# EAGLE schematic RX08 (EAGLE 6.6.0)

## Sheet 1 of 3
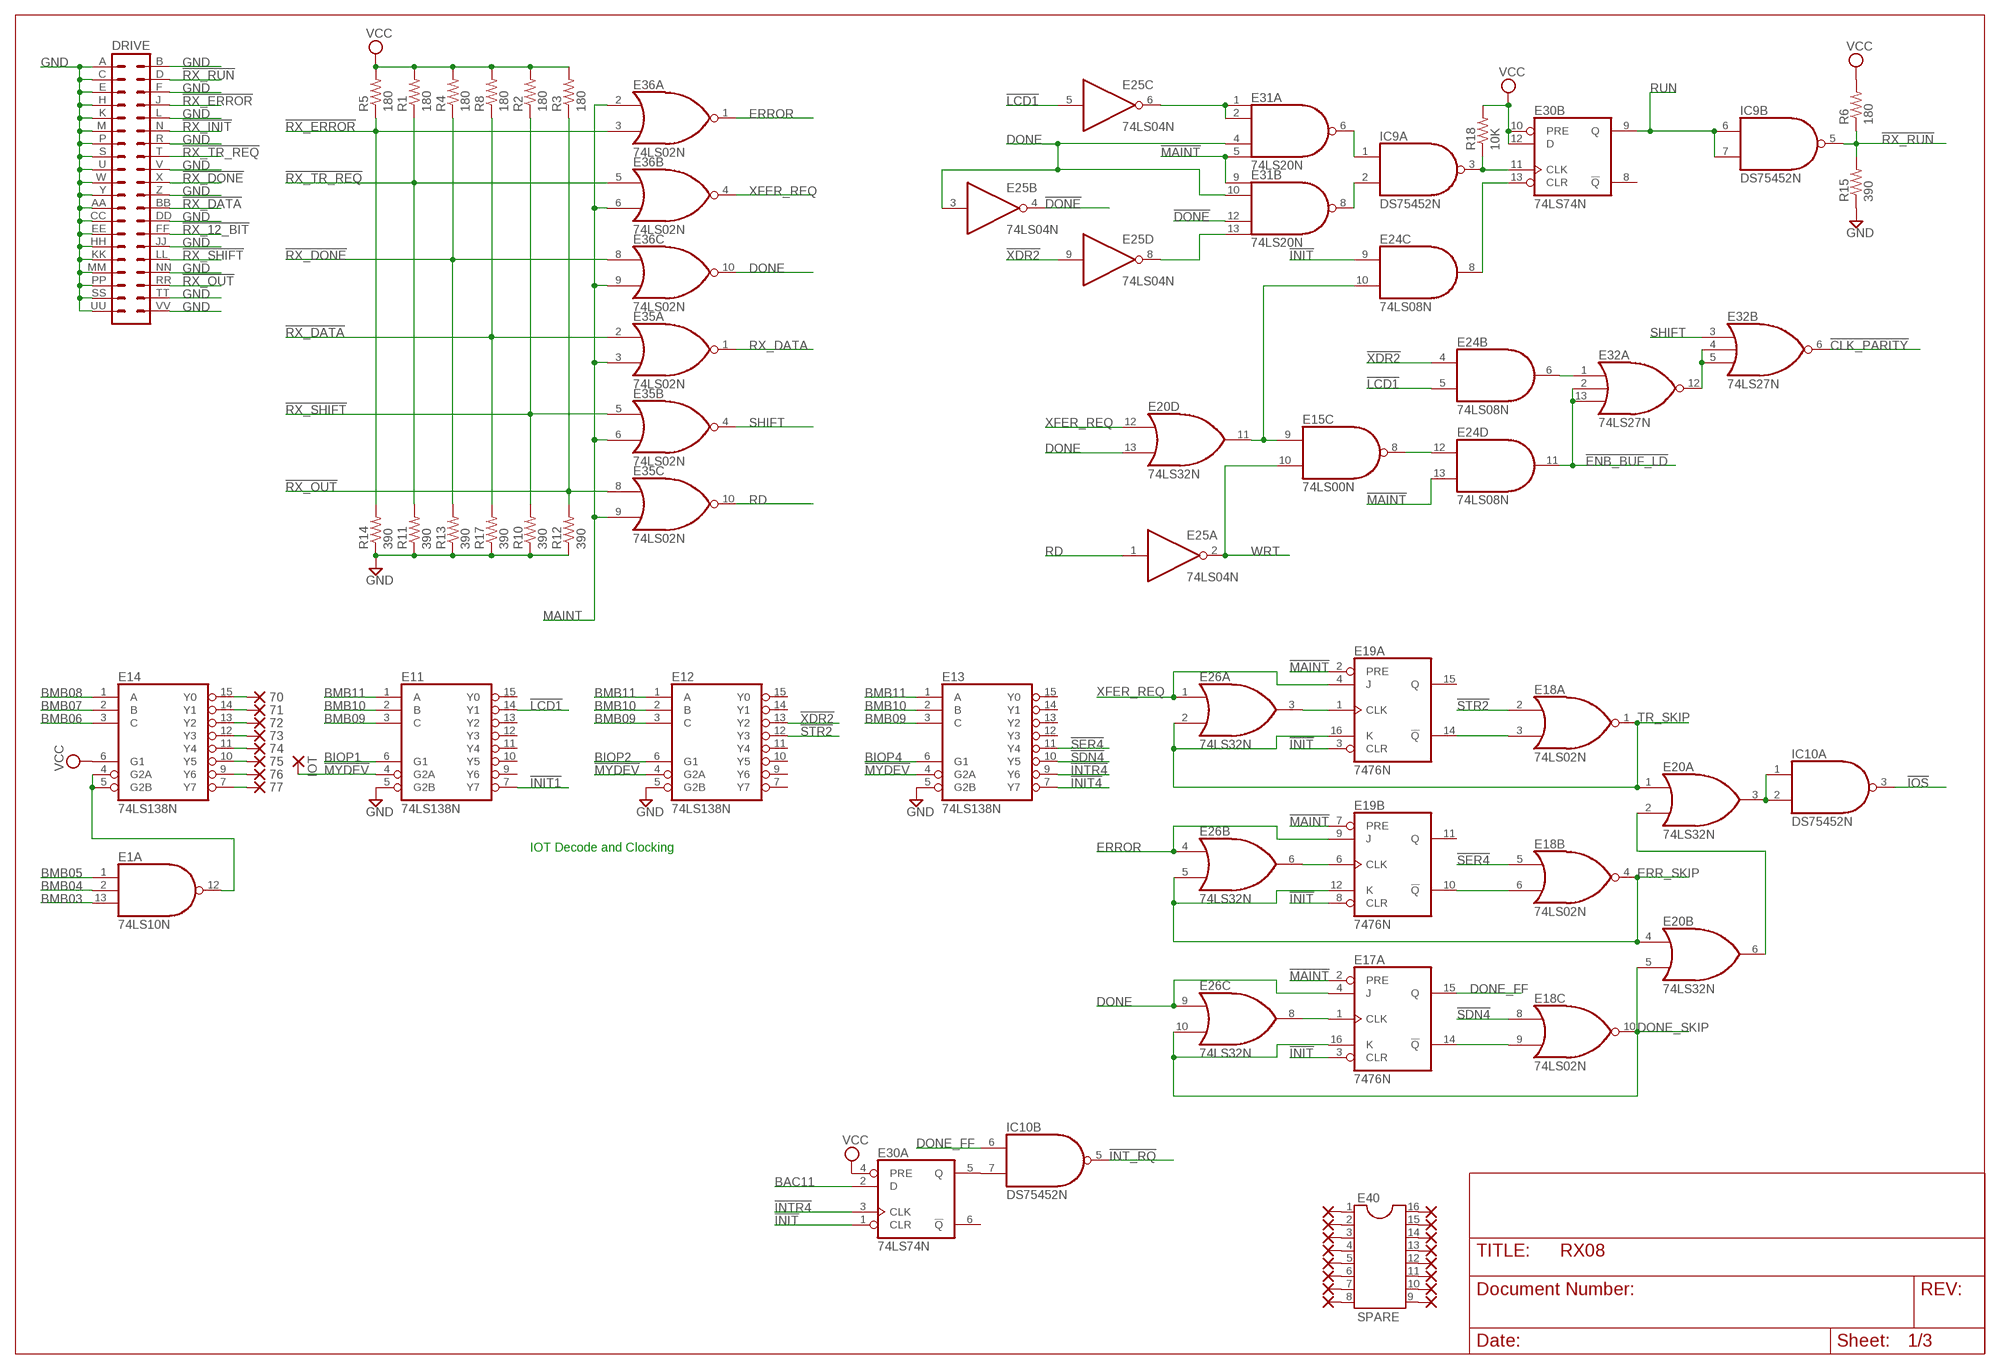
[diagram p0: schematic, sheet 1]

### Parts
70  1,6/0,8  [1,6/0,8]
71  1,6/0,8  [1,6/0,8]
72  1,6/0,8  [1,6/0,8]
73  1,6/0,8  [1,6/0,8]
74  1,6/0,8  [1,6/0,8]
75  1,6/0,8  [1,6/0,8]
76  1,6/0,8  [1,6/0,8]
77  1,6/0,8  [1,6/0,8]
DRIVE  DEC40PINV  [DEC40PINV]
E1  74LS10N  [DIL14]
E11  74LS138N  [DIL16]
E12  74LS138N  [DIL16]
E13  74LS138N  [DIL16]
E14  74LS138N  [DIL16]
E15  74LS00N  [DIL14]
E17  7476N  [DIL16]
E18  74LS02N  [DIL14]
E19  7476N  [DIL16]
E20  74LS32N  [DIL14]
E24  74LS08N  [DIL14]
E25  74LS04N  [DIL14]
E26  74LS32N  [DIL14]
E30  74LS74N  [DIL14]
E31  74LS20N  [DIL14]
E32  74LS27N  [DIL14]
E35  74LS02N  [DIL14]
E36  74LS02N  [DIL14]
E40  SPARE  DIL16  [DIL16]
IC9  DS75452N  [DIL08]
IC10  DS75452N  [DIL08]
IOT  1,6/0,8  [1,6/0,8]
PAD18  1,6/0,8  [1,6/0,8]
PAD19  1,6/0,8  [1,6/0,8]
PAD28  1,6/0,8  [1,6/0,8]
PAD29  1,6/0,8  [1,6/0,8]
PAD30  1,6/0,8  [1,6/0,8]
PAD31  1,6/0,8  [1,6/0,8]
PAD32  1,6/0,8  [1,6/0,8]
PAD33  1,6/0,8  [1,6/0,8]
PAD34  1,6/0,8  [1,6/0,8]
PAD35  1,6/0,8  [1,6/0,8]
PAD36  1,6/0,8  [1,6/0,8]
PAD37  1,6/0,8  [1,6/0,8]
PAD38  1,6/0,8  [1,6/0,8]
PAD39  1,6/0,8  [1,6/0,8]
PAD40  1,6/0,8  [1,6/0,8]
PAD41  1,6/0,8  [1,6/0,8]
R1  180  R-US_0207/10  [0207/10]
R2  180  R-US_0207/10  [0207/10]
R3  180  R-US_0207/10  [0207/10]
R4  180  R-US_0207/10  [0207/10]
R5  180  R-US_0207/10  [0207/10]
R6  180  R-US_0207/10  [0207/10]
R8  180  R-US_0207/10  [0207/10]
R10  390  R-US_0207/10  [0207/10]
R11  390  R-US_0207/10  [0207/10]
R12  390  R-US_0207/10  [0207/10]
R13  390  R-US_0207/10  [0207/10]
R14  390  R-US_0207/10  [0207/10]
R15  390  R-US_0207/10  [0207/10]
R17  390  R-US_0207/10  [0207/10]
R18  10K  R-US_0207/10  [0207/10]

### Nets
!CLK_PARITY: E32.6(B:O) ; also sheet 2
!DONE: E25.4(B:O) E31.12(B:I2) ; also sheet 2
!ENB_BUF_LD: E24.11(D:O) E32.2(A:I1) E32.13(A:I2) ; also sheet 2
!INIT: E17.3(A:CLR) E19.3(A:CLR) E19.8(B:CLR) E24.9(C:I0) E30.1(A:CLR) ; also sheet 2
!INIT1: E11.7(Y7) ; also sheet 2
!INIT4: E13.7(Y7) ; also sheet 2
!INT_RQ: IC10.5(B:O) ; also sheet 3
!INTR4: E13.9(Y6) E30.3(A:CLK)
!IOS: IC10.3(A:O) ; also sheet 3
!LCD1: E11.14(Y1) E24.5(B:I1) E25.5(C:I) ; also sheet 2
!MAINT: E17.2(A:PRE) E19.2(A:PRE) E19.7(B:PRE) E24.13(D:I1) E31.5(A:I3) E31.9(B:I0) ; also sheet 2
!MYDEV: E11.4(G2A) E12.4(G2A) E13.4(G2A) IOT.1(P)
!RX_12_BIT: DRIVE.FF ; also sheet 2
!RX_DATA: DRIVE.BB E35.2(A:I0) R8.1 R17.2 ; also sheet 2
!RX_DONE: DRIVE.X E36.8(C:I0) R4.1 R13.2
!RX_ERROR: DRIVE.J E36.3(A:I1) R5.1 R14.2
!RX_INIT: DRIVE.N ; also sheet 2
!RX_OUT: DRIVE.RR E35.8(C:I0) R3.1 R12.2
!RX_RUN: DRIVE.D IC9.5(B:O) R6.1 R15.2
!RX_SHIFT: DRIVE.LL E35.5(B:I0) R2.1 R10.2
!RX_TR_REQ: DRIVE.T E36.5(B:I0) R1.1 R11.2
!SDN4: E13.10(Y5) E18.8(C:I0)
!SER4: E13.11(Y4) E18.5(B:I0)
!STR2: E12.12(Y3) E18.2(A:I0)
!XDR2: E12.13(Y2) E24.4(B:I0) E25.9(D:I) ; also sheet 2
BAC11: E30.2(A:D) ; also sheet 2,3
BIOP1: E11.6(G1) ; also sheet 3
BIOP2: E12.6(G1) ; also sheet 3
BIOP4: E13.6(G1) ; also sheet 3
BMB03: E1.13(A:I2) ; also sheet 3
BMB04: E1.2(A:I1) ; also sheet 3
BMB05: E1.1(A:I0) ; also sheet 3
BMB06: E14.3(C) ; also sheet 3
BMB07: E14.2(B) ; also sheet 3
BMB08: E14.1(A) ; also sheet 3
BMB09: E11.3(C) E12.3(C) E13.3(C) ; also sheet 3
BMB10: E11.2(B) E12.2(B) E13.2(B) ; also sheet 3
BMB11: E11.1(A) E12.1(A) E13.1(A) ; also sheet 3
DONE: E17.4(A:J) E20.13(D:I1) E25.3(B:I) E26.9(C:I0) E31.4(A:I2) E31.10(B:I1) E36.10(C:O) ; also sheet 2
DONE_FF: E17.15(A:Q) IC10.6(B:I0)
DONE_SKIP: E17.16(A:K) E18.10(C:O) E20.5(B:I1) E26.10(C:I1)
ERR_SKIP: E18.4(B:O) E19.12(B:K) E20.4(B:I0) E26.5(B:I1)
ERROR: E19.9(B:J) E26.4(B:I0) E36.1(A:O)
GND [supply]: DRIVE.A DRIVE.AA DRIVE.B DRIVE.C DRIVE.CC DRIVE.DD DRIVE.E DRIVE.EE DRIVE.F DRIVE.H DRIVE.HH DRIVE.JJ DRIVE.K DRIVE.KK DRIVE.L DRIVE.M DRIVE.MM DRIVE.NN DRIVE.P DRIVE.PP DRIVE.R DRIVE.S DRIVE.SS DRIVE.TT DRIVE.U DRIVE.UU DRIVE.V DRIVE.VV DRIVE.W DRIVE.Y DRIVE.Z E11.5(G2B) E12.5(G2B) E13.5(G2B) R10.1 R11.1 R12.1 R13.1 R14.1 R15.1 R17.1 ; also sheet 2,3
LCD1: E25.6(C:O) E31.1(A:I0) E31.2(A:I1)
MAINT: E35.3(A:I1) E35.6(B:I1) E35.9(C:I1) E36.2(A:I0) E36.6(B:I1) E36.9(C:I1) ; also sheet 2
N$1: 76.1(P) E14.9(Y6)
N$5: 70.1(P) E14.15(Y0)
N$6: 71.1(P) E14.14(Y1)
N$7: 72.1(P) E14.13(Y2)
N$8: 73.1(P) E14.12(Y3)
N$9: 74.1(P) E14.11(Y4)
N$10: 75.1(P) E14.10(Y5)
N$11: 77.1(P) E14.7(Y7)
N$22: E15.9(C:I0) E20.11(D:O) E24.10(C:I1)
N$32: E15.8(C:O) E24.12(D:I0)
N$34: E40.1 PAD18.1(P)
N$41: E40.2 PAD19.1(P)
N$43: E40.3 PAD28.1(P)
N$44: E24.6(B:O) E32.1(A:I0)
N$49: E1.12(A:O) E14.4(G2A) E14.5(G2B)
N$50: E40.4 PAD29.1(P)
N$51: E40.5 PAD30.1(P)
N$52: E40.6 PAD31.1(P)
N$53: E40.7 PAD32.1(P)
N$54: E40.8 PAD33.1(P)
N$55: E40.16 PAD34.1(P)
N$56: E40.15 PAD35.1(P)
N$57: E40.14 PAD36.1(P)
N$58: E40.13 PAD37.1(P)
N$59: E40.12 PAD38.1(P)
N$61: E40.11 PAD39.1(P)
N$68: E40.10 PAD40.1(P)
N$69: E40.9 PAD41.1(P)
N$86: E30.5(A:Q) IC10.7(B:I1)
N$87: E32.4(B:I1) E32.5(B:I2) E32.12(A:O)
N$88: E20.2(A:I1) E20.6(B:O)
N$89: E20.3(A:O) IC10.1(A:I0) IC10.2(A:I1)
N$90: E19.6(B:CLK) E26.6(B:O)
N$91: E19.1(A:CLK) E26.3(A:O)
N$92: E18.3(A:I1) E19.14(A:!Q)
N$93: E18.6(B:I1) E19.10(B:!Q)
N$94: E30.11(B:CLK) IC9.3(A:O) R18.1
N$95: E31.8(B:O) IC9.2(A:I1)
N$96: E17.14(A:!Q) E18.9(C:I1)
N$97: E17.1(A:CLK) E26.8(C:O)
N$98: E31.6(A:O) IC9.1(A:I0)
N$99: E24.8(C:O) E30.13(B:CLR)
N$102: E25.8(D:O) E31.13(B:I3)
RD: E25.1(A:I) E35.10(C:O) ; also sheet 2
RUN: E30.9(B:Q) IC9.6(B:I0) IC9.7(B:I1) ; also sheet 2
RX_DATA: E35.1(A:O) ; also sheet 2
SHIFT: E32.3(B:I0) E35.4(B:O)
TR_SKIP: E18.1(A:O) E19.16(A:K) E20.1(A:I0) E26.2(A:I1)
VCC [supply]: E14.6(G1) E30.4(A:PRE) E30.10(B:PRE) E30.12(B:D) R1.2 R2.2 R3.2 R4.2 R5.2 R6.2 R8.2 R18.2 ; also sheet 2,3
WRT: E15.10(C:I1) E25.2(A:O) ; also sheet 2
XFER_REQ: E19.4(A:J) E20.12(D:I0) E26.1(A:I0) E36.4(B:O)
Unconnected: E11.9(Y6) E11.10(Y5) E11.11(Y4) E11.12(Y3) E11.13(Y2) E11.15(Y0) E12.7(Y7) E12.9(Y6) E12.10(Y5) E12.11(Y4) E12.14(Y1) E12.15(Y0) E13.12(Y3) E13.13(Y2) E13.14(Y1) E13.15(Y0) E19.11(B:Q) E19.15(A:Q) E30.6(A:!Q) E30.8(B:!Q)

### Notes on the sheet
- IOT Decode and Clocking

## Sheet 2 of 3
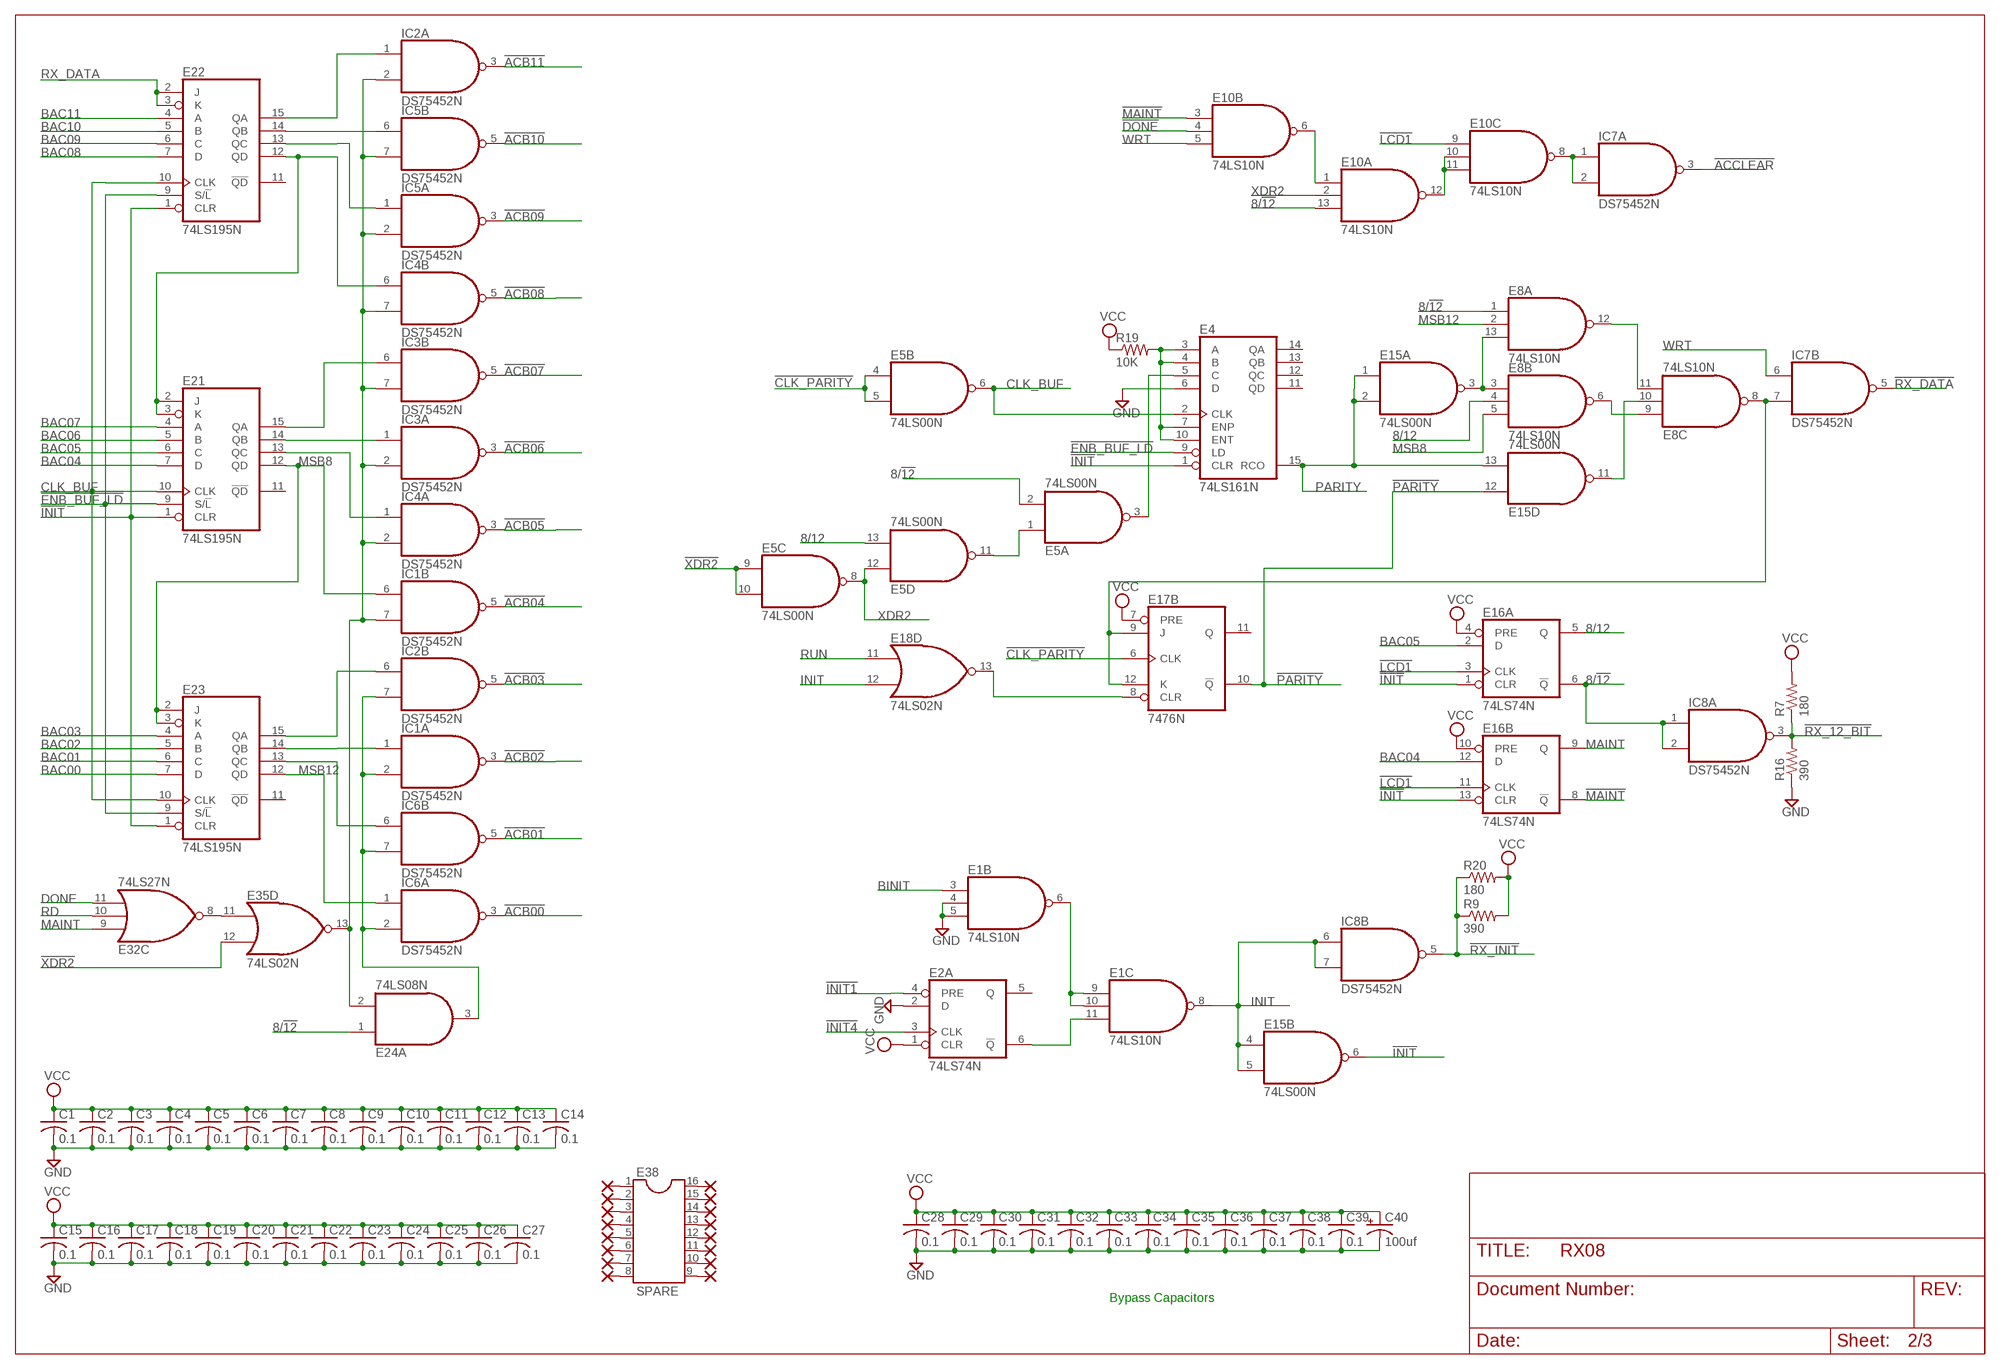
[diagram p1: schematic, sheet 2]

### Parts
C1  0.1  C-US050-025X075  [C050-025X075]
C2  0.1  C-US050-025X075  [C050-025X075]
C3  0.1  C-US050-025X075  [C050-025X075]
C4  0.1  C-US050-025X075  [C050-025X075]
C5  0.1  C-US050-025X075  [C050-025X075]
C6  0.1  C-US050-025X075  [C050-025X075]
C7  0.1  C-US050-025X075  [C050-025X075]
C8  0.1  C-US050-025X075  [C050-025X075]
C9  0.1  C-US050-025X075  [C050-025X075]
C10  0.1  C-US050-025X075  [C050-025X075]
C11  0.1  C-US050-025X075  [C050-025X075]
C12  0.1  C-US050-025X075  [C050-025X075]
C13  0.1  C-US050-025X075  [C050-025X075]
C14  0.1  C-US050-025X075  [C050-025X075]
C15  0.1  C-US050-025X075  [C050-025X075]
C16  0.1  C-US050-025X075  [C050-025X075]
C17  0.1  C-US050-025X075  [C050-025X075]
C18  0.1  C-US050-025X075  [C050-025X075]
C19  0.1  C-US050-025X075  [C050-025X075]
C20  0.1  C-US050-025X075  [C050-025X075]
C21  0.1  C-US050-025X075  [C050-025X075]
C22  0.1  C-US050-025X075  [C050-025X075]
C23  0.1  C-US050-025X075  [C050-025X075]
C24  0.1  C-US050-025X075  [C050-025X075]
C25  0.1  C-US050-025X075  [C050-025X075]
C26  0.1  C-US050-025X075  [C050-025X075]
C27  0.1  C-US050-025X075  [C050-025X075]
C28  0.1  C-US050-025X075  [C050-025X075]
C29  0.1  C-US050-025X075  [C050-025X075]
C30  0.1  C-US050-025X075  [C050-025X075]
C31  0.1  C-US050-025X075  [C050-025X075]
C32  0.1  C-US050-025X075  [C050-025X075]
C33  0.1  C-US050-025X075  [C050-025X075]
C34  0.1  C-US050-025X075  [C050-025X075]
C35  0.1  C-US050-025X075  [C050-025X075]
C36  0.1  C-US050-025X075  [C050-025X075]
C37  0.1  C-US050-025X075  [C050-025X075]
C38  0.1  C-US050-025X075  [C050-025X075]
C39  0.1  C-US050-025X075  [C050-025X075]
C40  100uf  CPOL-USE22-9AXIAL  [E22-9]
E2  74LS74N  [DIL14]
E4  74LS161N  [DIL16]
E5  74LS00N  [DIL14]
E8  74LS10N  [DIL14]
E10  74LS10N  [DIL14]
E16  74LS74N  [DIL14]
E21  74LS195N  [DIL16]
E22  74LS195N  [DIL16]
E23  74LS195N  [DIL16]
E38  SPARE  DIL16  [DIL16]
IC1  DS75452N  [DIL08]
IC2  DS75452N  [DIL08]
IC3  DS75452N  [DIL08]
IC4  DS75452N  [DIL08]
IC5  DS75452N  [DIL08]
IC6  DS75452N  [DIL08]
IC7  DS75452N  [DIL08]
IC8  DS75452N  [DIL08]
PAD10  1,6/0,8  [1,6/0,8]
PAD11  1,6/0,8  [1,6/0,8]
PAD12  1,6/0,8  [1,6/0,8]
PAD13  1,6/0,8  [1,6/0,8]
PAD14  1,6/0,8  [1,6/0,8]
PAD15  1,6/0,8  [1,6/0,8]
PAD16  1,6/0,8  [1,6/0,8]
PAD17  1,6/0,8  [1,6/0,8]
PAD20  1,6/0,8  [1,6/0,8]
PAD21  1,6/0,8  [1,6/0,8]
PAD22  1,6/0,8  [1,6/0,8]
PAD23  1,6/0,8  [1,6/0,8]
PAD24  1,6/0,8  [1,6/0,8]
PAD25  1,6/0,8  [1,6/0,8]
PAD26  1,6/0,8  [1,6/0,8]
PAD27  1,6/0,8  [1,6/0,8]
R7  180  R-US_0207/10  [0207/10]
R9  390  R-US_0207/10  [0207/10]
R16  390  R-US_0207/10  [0207/10]
R19  10K  R-US_0207/10  [0207/10]
R20  180  R-US_0207/10  [0207/10]

### Nets
8/12: E5.13(D:I1) E8.4(B:I1) E16.5(A:Q)
8/!12: E5.2(A:I1) E8.1(A:I0) E10.13(A:I2) E16.6(A:!Q) E24.1(A:I0) IC8.1(A:I0) IC8.2(A:I1)
!ACB00: IC6.3(A:O) ; also sheet 3
!ACB01: IC6.5(B:O) ; also sheet 3
!ACB02: IC1.3(A:O) ; also sheet 3
!ACB03: IC2.5(B:O) ; also sheet 3
!ACB04: IC1.5(B:O) ; also sheet 3
!ACB05: IC4.3(A:O) ; also sheet 3
!ACB06: IC3.3(A:O) ; also sheet 3
!ACB07: IC3.5(B:O) ; also sheet 3
!ACB08: IC4.5(B:O) ; also sheet 3
!ACB09: IC5.3(A:O) ; also sheet 3
!ACB10: IC5.5(B:O) ; also sheet 3
!ACB11: IC2.3(A:O) ; also sheet 3
!ACCLEAR: IC7.3(A:O) ; also sheet 3
!CLK_PARITY: E5.4(B:I0) E5.5(B:I1) E17.6(B:CLK) ; also sheet 1
!DONE: E10.4(B:I1) ; also sheet 1
!ENB_BUF_LD: E4.9(LD) E21.9(S/!L) E22.9(S/!L) E23.9(S/!L) ; also sheet 1
!INIT: E4.1(CLR) E15.6(B:O) E16.1(A:CLR) E16.13(B:CLR) E21.1(CLR) E22.1(CLR) E23.1(CLR) ; also sheet 1
!INIT1: E2.4(A:PRE) ; also sheet 1
!INIT4: E2.3(A:CLK) ; also sheet 1
!LCD1: E10.9(C:I0) E16.3(A:CLK) E16.11(B:CLK) ; also sheet 1
!MAINT: E10.3(B:I0) E16.8(B:!Q) ; also sheet 1
!PARITY: E15.12(D:I0) E17.10(B:!Q)
!RX_12_BIT: IC8.3(A:O) R7.1 R16.2 ; also sheet 1
!RX_DATA: IC7.5(B:O) ; also sheet 1
!RX_INIT: IC8.5(B:O) R9.1 R20.1 ; also sheet 1
!XDR2: E5.9(C:I0) E5.10(C:I1) E35.12(D:I1) ; also sheet 1
BAC00: E23.7(D) ; also sheet 3
BAC01: E23.6(C) ; also sheet 3
BAC02: E23.5(B) ; also sheet 3
BAC03: E23.4(A) ; also sheet 3
BAC04: E16.12(B:D) E21.7(D) ; also sheet 3
BAC05: E16.2(A:D) E21.6(C) ; also sheet 3
BAC06: E21.5(B) ; also sheet 3
BAC07: E21.4(A) ; also sheet 3
BAC08: E22.7(D) ; also sheet 3
BAC09: E22.6(C) ; also sheet 3
BAC10: E22.5(B) ; also sheet 3
BAC11: E22.4(A) ; also sheet 1,3
BINIT: E1.3(B:I0) ; also sheet 3
CLK_BUF: E4.2(CLK) E5.6(B:O) E21.10(CLK) E22.10(CLK) E23.10(CLK)
DONE: E32.11(C:I2) ; also sheet 1
GND [supply]: C1.2 C2.2 C3.2 C4.2 C5.2 C6.2 C7.2 C8.2 C9.2 C10.2 C11.2 C12.2 C13.2 C14.2 C15.2 C16.2 C17.2 C18.2 C19.2 C20.2 C21.2 C22.2 C23.2 C24.2 C25.2 C26.2 C27.2 C28.2 C29.2 C30.2 C31.2 C32.2 C33.2 C34.2 C35.2 C36.2 C37.2 C38.2 C39.2 C40.- E1.4(B:I1) E1.5(B:I2) E2.2(A:D) E4.6(D) R16.1 ; also sheet 1,3
INIT: E1.8(C:O) E15.4(B:I0) E15.5(B:I1) E18.12(D:I1) IC8.6(B:I0) IC8.7(B:I1)
MAINT: E16.9(B:Q) E32.9(C:I0) ; also sheet 1
MSB8: E8.5(B:I2) E21.12(QD) E23.2(J) E23.3(K) IC1.6(B:I0)
MSB12: E8.2(A:I1) E23.12(QD) IC6.1(A:I0)
N$2: E23.14(QB) IC1.1(A:I0)
N$3: E24.2(A:I1) E35.13(D:O) IC1.7(B:I1) IC2.2(A:I1) IC3.2(A:I1) IC3.7(B:I1) IC4.2(A:I1) IC4.7(B:I1) IC5.2(A:I1) IC5.7(B:I1)
N$4: E32.8(C:O) E35.11(D:I0)
N$12: E24.3(A:O) IC1.2(A:I1) IC2.7(B:I1) IC6.2(A:I1) IC6.7(B:I1)
N$13: E38.1 PAD10.1(P)
N$14: E38.2 PAD11.1(P)
N$15: E38.3 PAD12.1(P)
N$16: E38.4 PAD13.1(P)
N$17: E38.5 PAD14.1(P)
N$18: E38.6 PAD15.1(P)
N$19: E38.7 PAD16.1(P)
N$20: E38.8 PAD17.1(P)
N$21: E4.5(C) E5.3(A:O)
N$23: E38.16 PAD20.1(P)
N$24: E38.15 PAD21.1(P)
N$25: E38.14 PAD22.1(P)
N$26: E38.13 PAD23.1(P)
N$27: E38.12 PAD24.1(P)
N$28: E38.11 PAD25.1(P)
N$29: E38.10 PAD26.1(P)
N$30: E38.9 PAD27.1(P)
N$31: E21.2(J) E21.3(K) E22.12(QD) IC4.6(B:I0)
N$33: E23.13(QC) IC6.6(B:I0)
N$35: E5.1(A:I0) E5.11(D:O)
N$37: E8.3(B:I0) E8.13(A:I2) E15.3(A:O)
N$38: E8.11(C:I2) E8.12(A:O)
N$39: E8.6(B:O) E8.9(C:I0)
N$40: E8.10(C:I1) E15.11(D:O)
N$42: E8.8(C:O) E17.9(B:J) E17.12(B:K) IC7.7(B:I1)
N$45: E1.11(C:I2) E2.6(A:!Q)
N$46: E17.8(B:CLR) E18.13(D:O)
N$47: E1.6(B:O) E1.9(C:I0) E1.10(C:I1)
N$48: E4.3(A) E4.4(B) E4.7(ENP) E4.10(ENT) R19.2
N$60: E23.15(QA) IC2.6(B:I0)
N$62: E21.13(QC) IC4.1(A:I0)
N$63: E21.14(QB) IC3.1(A:I0)
N$64: E21.15(QA) IC3.6(B:I0)
N$65: E22.15(QA) IC2.1(A:I0)
N$66: E22.13(QC) IC5.1(A:I0)
N$67: E22.14(QB) IC5.6(B:I0)
N$104: E10.1(A:I0) E10.6(B:O)
N$105: E10.10(C:I1) E10.11(C:I2) E10.12(A:O)
N$106: E10.8(C:O) IC7.1(A:I0) IC7.2(A:I1)
PARITY: E4.15(RCO) E15.1(A:I0) E15.2(A:I1) E15.13(D:I1)
RD: E32.10(C:I1) ; also sheet 1
RUN: E18.11(D:I0) ; also sheet 1
RX_DATA: E22.2(J) E22.3(K) ; also sheet 1
VCC [supply]: C1.1 C2.1 C3.1 C4.1 C5.1 C6.1 C7.1 C8.1 C9.1 C10.1 C11.1 C12.1 C13.1 C14.1 C15.1 C16.1 C17.1 C18.1 C19.1 C20.1 C21.1 C22.1 C23.1 C24.1 C25.1 C26.1 C27.1 C28.1 C29.1 C30.1 C31.1 C32.1 C33.1 C34.1 C35.1 C36.1 C37.1 C38.1 C39.1 C40.+ E2.1(A:CLR) E16.4(A:PRE) E16.10(B:PRE) E17.7(B:PRE) R7.2 R9.2 R19.1 R20.2 ; also sheet 1,3
WRT: E10.5(B:I2) IC7.6(B:I0) ; also sheet 1
XDR2: E5.8(C:O) E5.12(D:I0) E10.2(A:I1)
Unconnected: E2.5(A:Q) E4.11(QD) E4.12(QC) E4.13(QB) E4.14(QA) E17.11(B:Q) E21.11(!QD) E22.11(!QD) E23.11(!QD)

### Notes on the sheet
- Bypass Capacitors

## Sheet 3 of 3
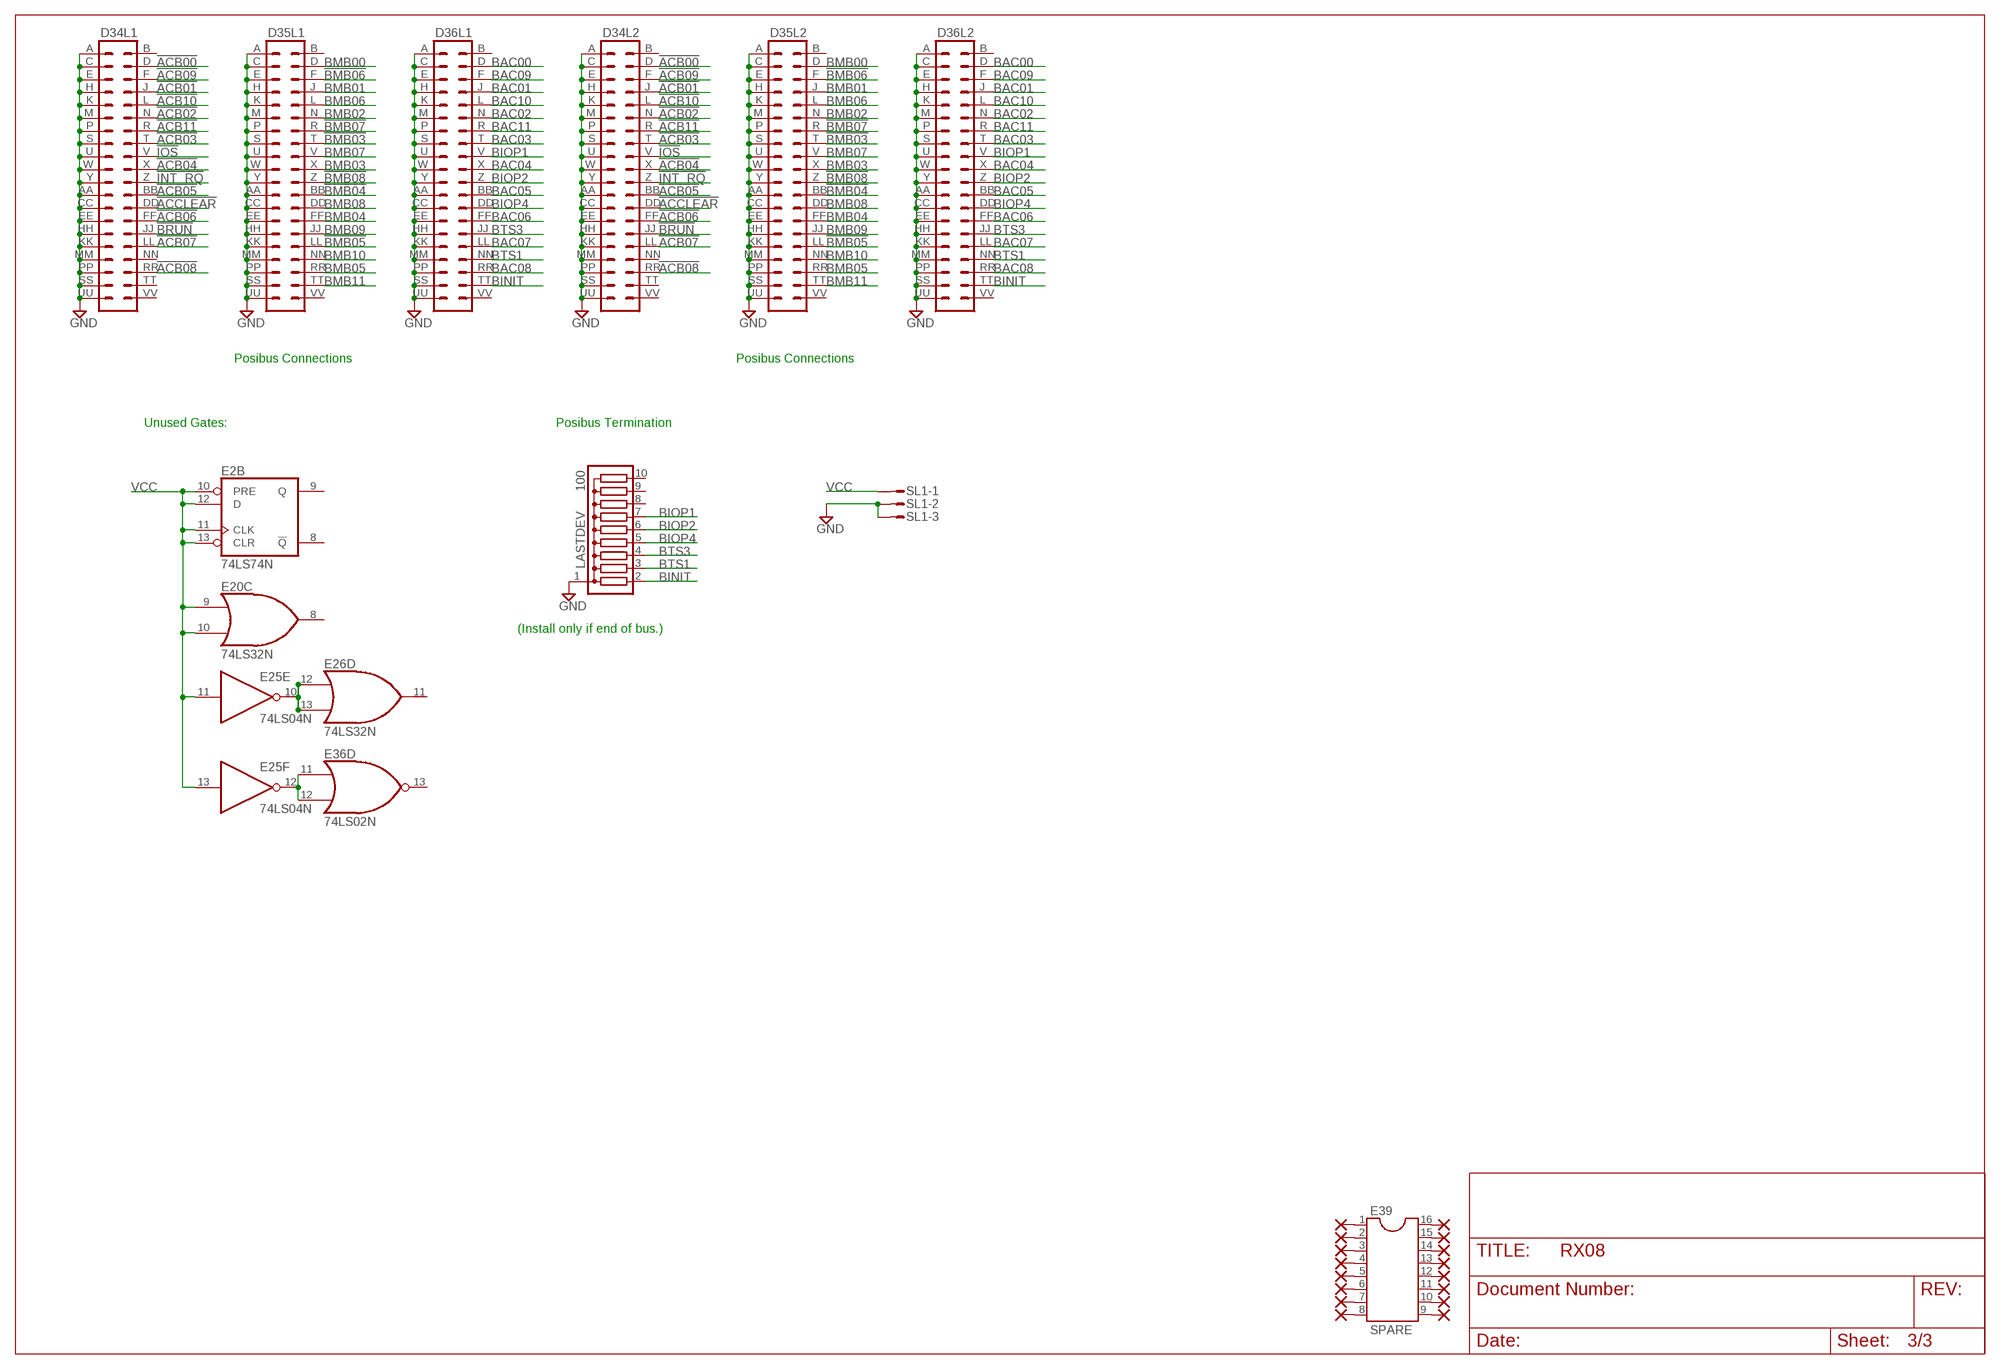
[diagram p2: schematic, sheet 3]

### Parts
D34L1  DEC40PINV  [DEC40PINV]
D34L2  DEC40PINV  [DEC40PINV]
D35L1  DEC40PINV  [DEC40PINV]
D35L2  DEC40PINV  [DEC40PINV]
D36L1  DEC40PINV  [DEC40PINV]
D36L2  DEC40PINV  [DEC40PINV]
E39  SPARE  DIL16  [DIL16]
LASTDEV  100  G09R  [SIL10]
PAD42  1,6/0,8  [1,6/0,8]
PAD43  1,6/0,8  [1,6/0,8]
PAD44  1,6/0,8  [1,6/0,8]
PAD45  1,6/0,8  [1,6/0,8]
PAD46  1,6/0,8  [1,6/0,8]
PAD47  1,6/0,8  [1,6/0,8]
PAD48  1,6/0,8  [1,6/0,8]
PAD49  1,6/0,8  [1,6/0,8]
PAD50  1,6/0,8  [1,6/0,8]
PAD51  1,6/0,8  [1,6/0,8]
PAD52  1,6/0,8  [1,6/0,8]
PAD53  1,6/0,8  [1,6/0,8]
PAD54  1,6/0,8  [1,6/0,8]
PAD55  1,6/0,8  [1,6/0,8]
PAD56  1,6/0,8  [1,6/0,8]
PAD57  1,6/0,8  [1,6/0,8]
SL1  MA04S  [04PA]

### Nets
!ACB00: D34L1.D D34L2.D ; also sheet 2
!ACB01: D34L1.J D34L2.J ; also sheet 2
!ACB02: D34L1.N D34L2.N ; also sheet 2
!ACB03: D34L1.T D34L2.T ; also sheet 2
!ACB04: D34L1.X D34L2.X ; also sheet 2
!ACB05: D34L1.BB D34L2.BB ; also sheet 2
!ACB06: D34L1.FF D34L2.FF ; also sheet 2
!ACB07: D34L1.LL D34L2.LL ; also sheet 2
!ACB08: D34L1.RR D34L2.RR ; also sheet 2
!ACB09: D34L1.F D34L2.F ; also sheet 2
!ACB10: D34L1.L D34L2.L ; also sheet 2
!ACB11: D34L1.R D34L2.R ; also sheet 2
!ACCLEAR: D34L1.DD D34L2.DD ; also sheet 2
!BMB03: D35L1.T D35L2.T
!BMB04: D35L1.BB D35L2.BB
!BMB05: D35L1.LL D35L2.LL
!BMB06: D35L1.F D35L2.F
!BMB07: D35L1.R D35L2.R
!BMB08: D35L1.Z D35L2.Z
!BRUN: D34L1.JJ D34L2.JJ
!INT_RQ: D34L1.Z D34L2.Z ; also sheet 1
!IOS: D34L1.V D34L2.V ; also sheet 1
BAC00: D36L1.D D36L2.D ; also sheet 2
BAC01: D36L1.J D36L2.J ; also sheet 2
BAC02: D36L1.N D36L2.N ; also sheet 2
BAC03: D36L1.T D36L2.T ; also sheet 2
BAC04: D36L1.X D36L2.X ; also sheet 2
BAC05: D36L1.BB D36L2.BB ; also sheet 2
BAC06: D36L1.FF D36L2.FF ; also sheet 2
BAC07: D36L1.LL D36L2.LL ; also sheet 2
BAC08: D36L1.RR D36L2.RR ; also sheet 2
BAC09: D36L1.F D36L2.F ; also sheet 2
BAC10: D36L1.L D36L2.L ; also sheet 2
BAC11: D36L1.R D36L2.R ; also sheet 1,2
BINIT: D36L1.TT D36L2.TT LASTDEV.2 ; also sheet 2
BIOP1: D36L1.V D36L2.V LASTDEV.7 ; also sheet 1
BIOP2: D36L1.Z D36L2.Z LASTDEV.6 ; also sheet 1
BIOP4: D36L1.DD D36L2.DD LASTDEV.5 ; also sheet 1
BMB00: D35L1.D D35L2.D
BMB01: D35L1.J D35L2.J
BMB02: D35L1.N D35L2.N
BMB03: D35L1.X D35L2.X ; also sheet 1
BMB04: D35L1.FF D35L2.FF ; also sheet 1
BMB05: D35L1.RR D35L2.RR ; also sheet 1
BMB06: D35L1.L D35L2.L ; also sheet 1
BMB07: D35L1.V D35L2.V ; also sheet 1
BMB08: D35L1.DD D35L2.DD ; also sheet 1
BMB09: D35L1.JJ D35L2.JJ ; also sheet 1
BMB10: D35L1.NN D35L2.NN ; also sheet 1
BMB11: D35L1.TT D35L2.TT ; also sheet 1
BTS1: D36L1.NN D36L2.NN LASTDEV.3
BTS3: D36L1.JJ D36L2.JJ LASTDEV.4
GND [supply]: D34L1.A D34L1.AA D34L1.C D34L1.CC D34L1.E D34L1.EE D34L1.H D34L1.HH D34L1.K D34L1.KK D34L1.M D34L1.MM D34L1.P D34L1.PP D34L1.S D34L1.SS D34L1.U D34L1.UU D34L1.W D34L1.Y D34L2.A D34L2.AA D34L2.C D34L2.CC D34L2.E D34L2.EE D34L2.H D34L2.HH D34L2.K D34L2.KK D34L2.M D34L2.MM D34L2.P D34L2.PP D34L2.S D34L2.SS D34L2.U D34L2.UU D34L2.W D34L2.Y D35L1.A D35L1.AA D35L1.C D35L1.CC D35L1.E D35L1.EE D35L1.H D35L1.HH D35L1.K D35L1.KK D35L1.M D35L1.MM D35L1.P D35L1.PP D35L1.S D35L1.SS D35L1.U D35L1.UU D35L1.W D35L1.Y D35L2.A D35L2.AA D35L2.C D35L2.CC D35L2.E D35L2.EE D35L2.H D35L2.HH D35L2.K D35L2.KK D35L2.M D35L2.MM D35L2.P D35L2.PP D35L2.S D35L2.SS D35L2.U D35L2.UU D35L2.W D35L2.Y D36L1.A D36L1.AA D36L1.C D36L1.CC D36L1.E D36L1.EE D36L1.H D36L1.HH D36L1.K D36L1.KK D36L1.M D36L1.MM D36L1.P D36L1.PP D36L1.S D36L1.SS D36L1.U D36L1.UU D36L1.W D36L1.Y D36L2.A D36L2.AA D36L2.C D36L2.CC D36L2.E D36L2.EE D36L2.H D36L2.HH D36L2.K D36L2.KK D36L2.M D36L2.MM D36L2.P D36L2.PP D36L2.S D36L2.SS D36L2.U D36L2.UU D36L2.W D36L2.Y LASTDEV.1 SL1.2 SL1.3 ; also sheet 1,2
N$70: E39.1 PAD42.1(P)
N$71: E39.2 PAD43.1(P)
N$72: E39.3 PAD44.1(P)
N$73: E39.4 PAD45.1(P)
N$74: E39.5 PAD46.1(P)
N$75: E39.6 PAD47.1(P)
N$76: E39.7 PAD48.1(P)
N$77: E39.8 PAD49.1(P)
N$78: E39.16 PAD50.1(P)
N$79: E39.15 PAD51.1(P)
N$80: E39.14 PAD52.1(P)
N$81: E39.13 PAD53.1(P)
N$82: E39.12 PAD54.1(P)
N$83: E39.11 PAD55.1(P)
N$84: E39.10 PAD56.1(P)
N$85: E39.9 PAD57.1(P)
N$100: E25.10(E:O) E26.12(D:I0) E26.13(D:I1)
N$101: E25.12(F:O) E36.11(D:I0) E36.12(D:I1)
VCC [supply]: E2.10(B:PRE) E2.11(B:CLK) E2.12(B:D) E2.13(B:CLR) E20.9(C:I0) E20.10(C:I1) E25.11(E:I) E25.13(F:I) SL1.1 ; also sheet 1,2
Unconnected: D34L1.B D34L1.NN D34L1.TT D34L1.VV D34L2.B D34L2.NN D34L2.TT D34L2.VV D35L1.B D35L1.VV D35L2.B D35L2.VV D36L1.B D36L1.VV D36L2.B D36L2.VV E2.8(B:!Q) E2.9(B:Q) E20.8(C:O) E26.11(D:O) E36.13(D:O) LASTDEV.8 LASTDEV.9 LASTDEV.10 SL1.4

### Notes on the sheet
- Posibus Connections | Posibus Connections
- Unused Gates: | Posibus Termination
- (Install only if end of bus.)

## Power pins joined to a net without a drawn wire
GND: E1.7(P:GND) E2.7(P:GND) E4.8(GND) E5.7(P:GND) E8.7(P:GND) E10.7(P:GND) E11.8(GND) E12.8(GND) E13.8(GND) E14.8(GND) E15.7(P:GND) E16.7(P:GND) E17.13(P:GND) E18.7(P:GND) E19.13(P:GND) E20.7(P:GND) E21.8(GND) E22.8(GND) E23.8(GND) E24.7(P:GND) E25.7(P:GND) E26.7(P:GND) E30.7(P:GND) E31.7(P:GND) E32.7(P:GND) E35.7(P:GND) E36.7(P:GND) IC1.4(P:GND) IC2.4(P:GND) IC3.4(P:GND) IC4.4(P:GND) IC5.4(P:GND) IC6.4(P:GND) IC7.4(P:GND) IC8.4(P:GND) IC9.4(P:GND) IC10.4(P:GND)
VCC: E1.14(P:VCC) E2.14(P:VCC) E4.16(VCC) E5.14(P:VCC) E8.14(P:VCC) E10.14(P:VCC) E11.16(VCC) E12.16(VCC) E13.16(VCC) E14.16(VCC) E15.14(P:VCC) E16.14(P:VCC) E17.5(P:VCC) E18.14(P:VCC) E19.5(P:VCC) E20.14(P:VCC) E21.16(VCC) E22.16(VCC) E23.16(VCC) E24.14(P:VCC) E25.14(P:VCC) E26.14(P:VCC) E30.14(P:VCC) E31.14(P:VCC) E32.14(P:VCC) E35.14(P:VCC) E36.14(P:VCC) IC1.8(P:VCC) IC2.8(P:VCC) IC3.8(P:VCC) IC4.8(P:VCC) IC5.8(P:VCC) IC6.8(P:VCC) IC7.8(P:VCC) IC8.8(P:VCC) IC9.8(P:VCC) IC10.8(P:VCC)

## Library data of the parts
70-77 IOT PAD10-PAD57 = wirepad:1,6/0,8: THROUGH-HOLE PAD
C1-C39 = rcl:C-US: CAPACITOR, American symbol
C40 = rcl:CPOL-US: POLARIZED CAPACITOR, American symbol
D34L1 D34L2 D35L1 D35L2 D36L1 D36L2 DRIVE = dec-con:DEC40PIN: PIN HEADER
E1 E8 E10 = 74xx-us:74*10: Triple 3-input NAND gate
E2 E16 E30 = 74xx-us:74*74: Dual D type positive edge triggered FLIP FLOP, preset and clear
E4 = dec-con:74*161: Synchronous 4-bit COUNTER
E5 E15 = 74xx-us:74*00: Quad 2-input NAND gate
E11-E14 = 74xx-us:74*138: 3-line to 8-line DECODER/DEMULTIPLEXER
E17 E19 = 74xx-us:74*76: Dual J-K FLIP FLOP, preset and clear
E18 E35 E36 = 74xx-us:74*02: Quad 2-input NOR gate
E20 E26 = 74xx-us:74*32: Quad 2-input OR gate
E21-E23 = 74xx-us:74*195: 4-bit parallel access SHIFT REGISTER
E24 = 74xx-us:74*08: Quad 2-input AND gate
E25 = 74xx-us:74*04: Hex INVERTER
E31 = 74xx-us:74*20: Dual 4-input NAND gate
E32 = 74xx-us:74*27: Triple 3-input NOR gate
E38-E40 = ic-package:DIL16: Dual In Line / Socket
IC1-IC10 = dec-con:DS75452: Quad 2-input NAND gate, open collector output
LASTDEV = resistor-sil:G09R: SIL RESISTOR; OC_FARNELL: unknown; OC_NEWARK: unknown
R1-R20 = rcl:R-US_: RESISTOR, American symbol
SL1 = con-amp-quick:MA04S: AMP QUICK CONNECTOR; OC_FARNELL: unknown; OC_NEWARK: unknown

## Net classes
1 supply: width 0.508 mm